# EAGLE schematic HoverBoard_CoolAndFun (EAGLE 8.3.0)

## Sheet 1 of 2
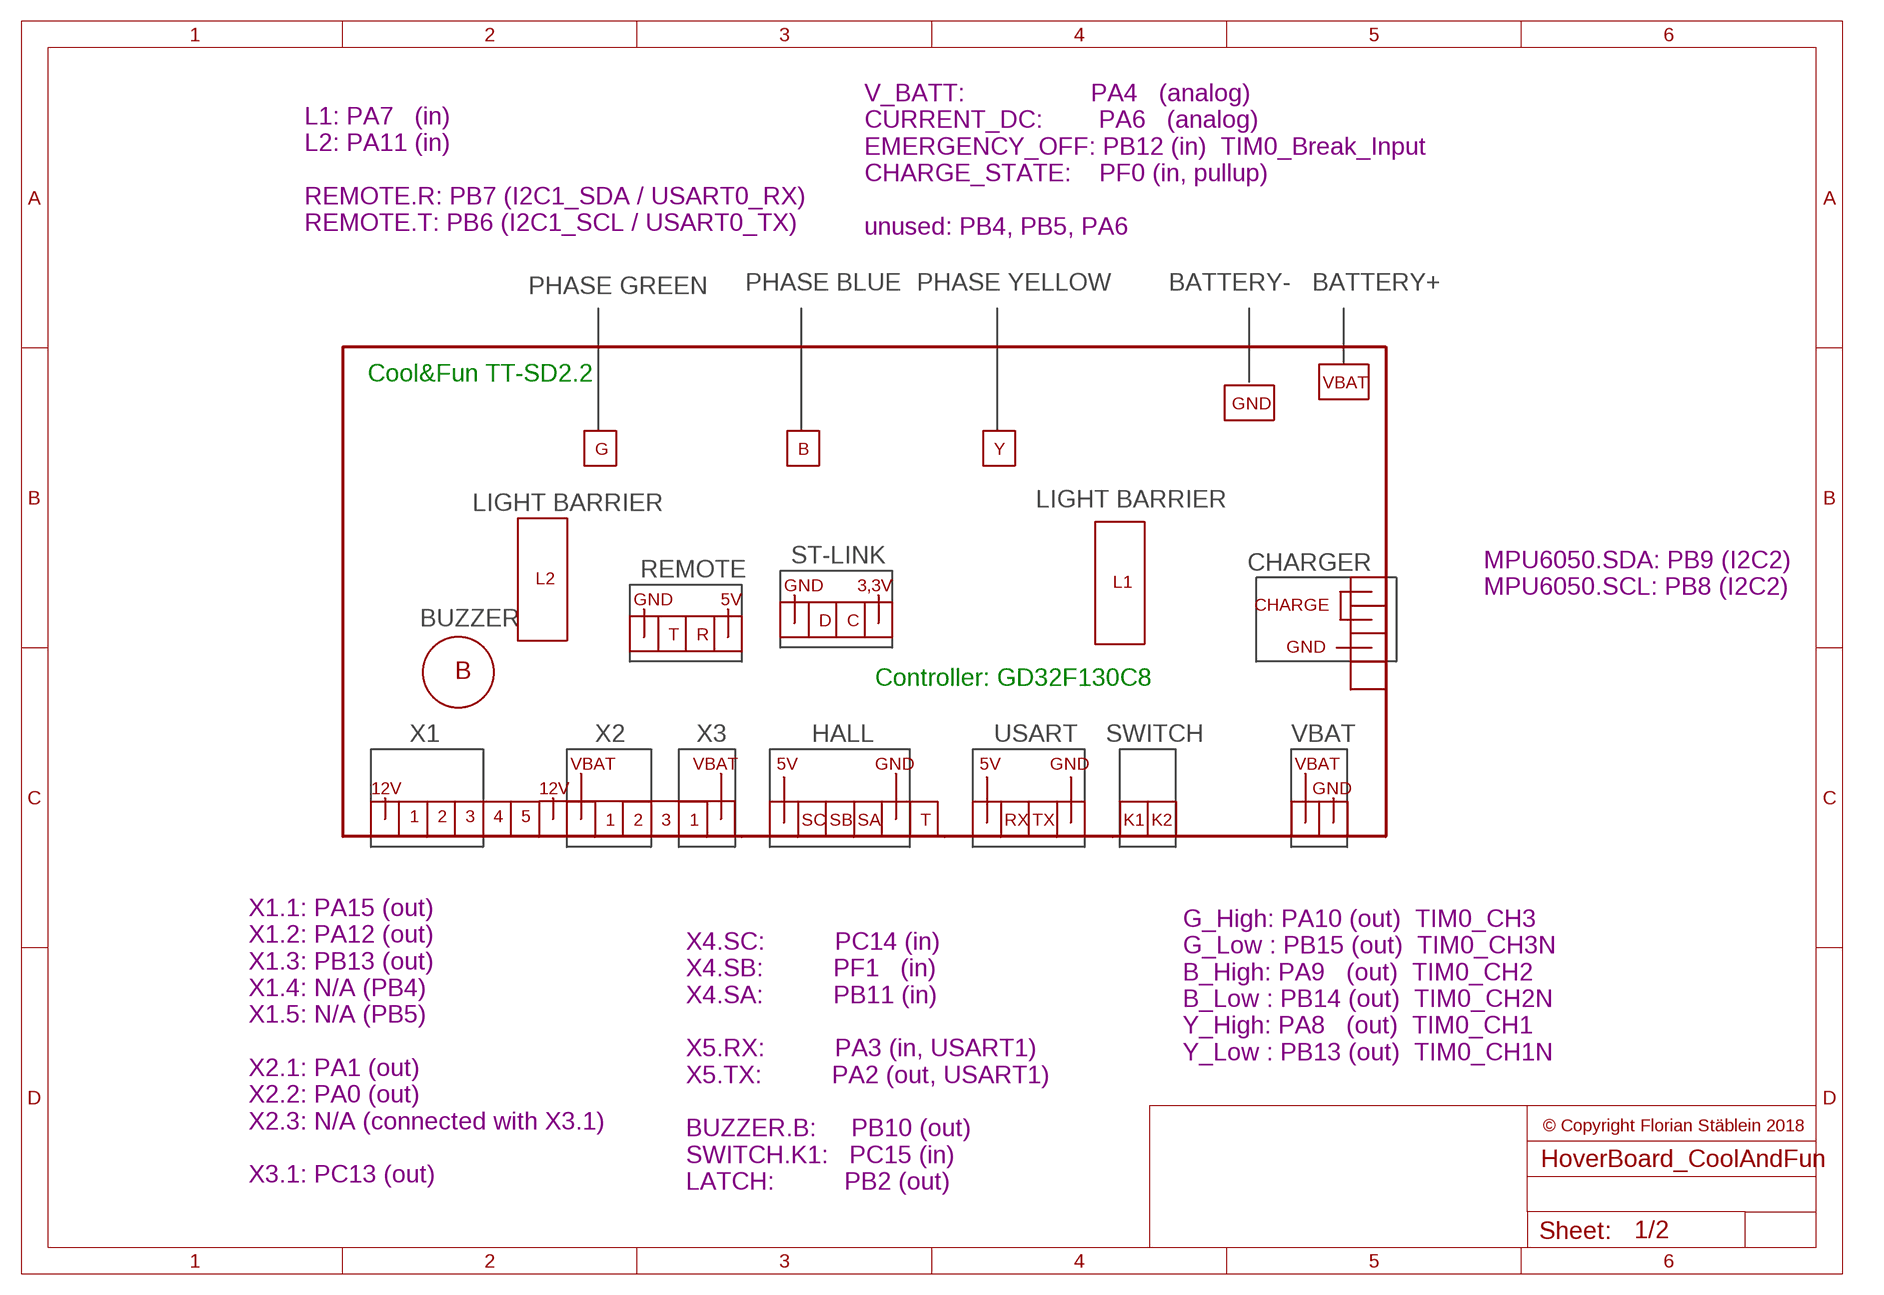
[diagram p0: schematic, sheet 1]

### Notes on the sheet
- L1: PA7   (in)
  L2: PA11 (in)
  
  REMOTE.R: PB7 (I2C1_SDA / USART0_RX)
  REMOTE.T: PB6 (I2C1_SCL / USART0_TX)
- V_BATT:                  PA4   (analog)
  CURRENT_DC:        PA6   (analog)
  EMERGENCY_OFF: PB12 (in)  TIM0_Break_Input
  CHARGE_STATE:    PF0 (in, pullup)
  
  unused: PB4, PB5, PA6
- PHASE GREEN | PHASE BLUE | PHASE YELLOW | BATTERY- | BATTERY+
- Cool&Fun TT-SD2.2
- VBAT
- GND
- G | B | Y
- LIGHT BARRIER | LIGHT BARRIER
- CHARGER
- ST-LINK
- REMOTE
- L2 | L1
- GND | 3,3V
- MPU6050.SDA: PB9 (I2C2)
  MPU6050.SCL: PB8 (I2C2)
- CHARGE
- GND | 5V
- BUZZER | D | C
- T | R | GND
- B | Controller: GD32F130C8
- X1 | X2 | X3 | HALL | USART | SWITCH | VBAT
- VBAT | VBAT | 5V | GND | 5V | GND | VBAT
- 12V | 12V | GND
- 1 | 2 | 3 | 4 | 5 | 1 | 2 | 3 | 1 | SC | SB | SA | T | RX | TX | K1 | K2
- G_High: PA10 (out)  TIM0_CH3
  G_Low : PB15 (out)  TIM0_CH3N
  B_High: PA9   (out)  TIM0_CH2
  B_Low : PB14 (out)  TIM0_CH2N
  Y_High: PA8   (out)  TIM0_CH1
  Y_Low : PB13 (out)  TIM0_CH1N
- © Copyright Florian Stäblein 2018
- X1.1: PA15 (out)
  X1.2: PA12 (out)
  X1.3: PB13 (out)
  X1.4: N/A (PB4)
  X1.5: N/A (PB5)
  
  X2.1: PA1 (out)
  X2.2: PA0 (out)
  X2.3: N/A (connected with X3.1)
  
  X3.1: PC13 (out)
- X4.SC:          PC14 (in)
  X4.SB:          PF1   (in)
  X4.SA:          PB11 (in)
  
  X5.RX:          PA3 (in, USART1)
  X5.TX:          PA2 (out, USART1)
  
  BUZZER.B:     PB10 (out)
  SWITCH.K1:   PC15 (in)
  LATCH:          PB2 (out)

## Sheet 2 of 2
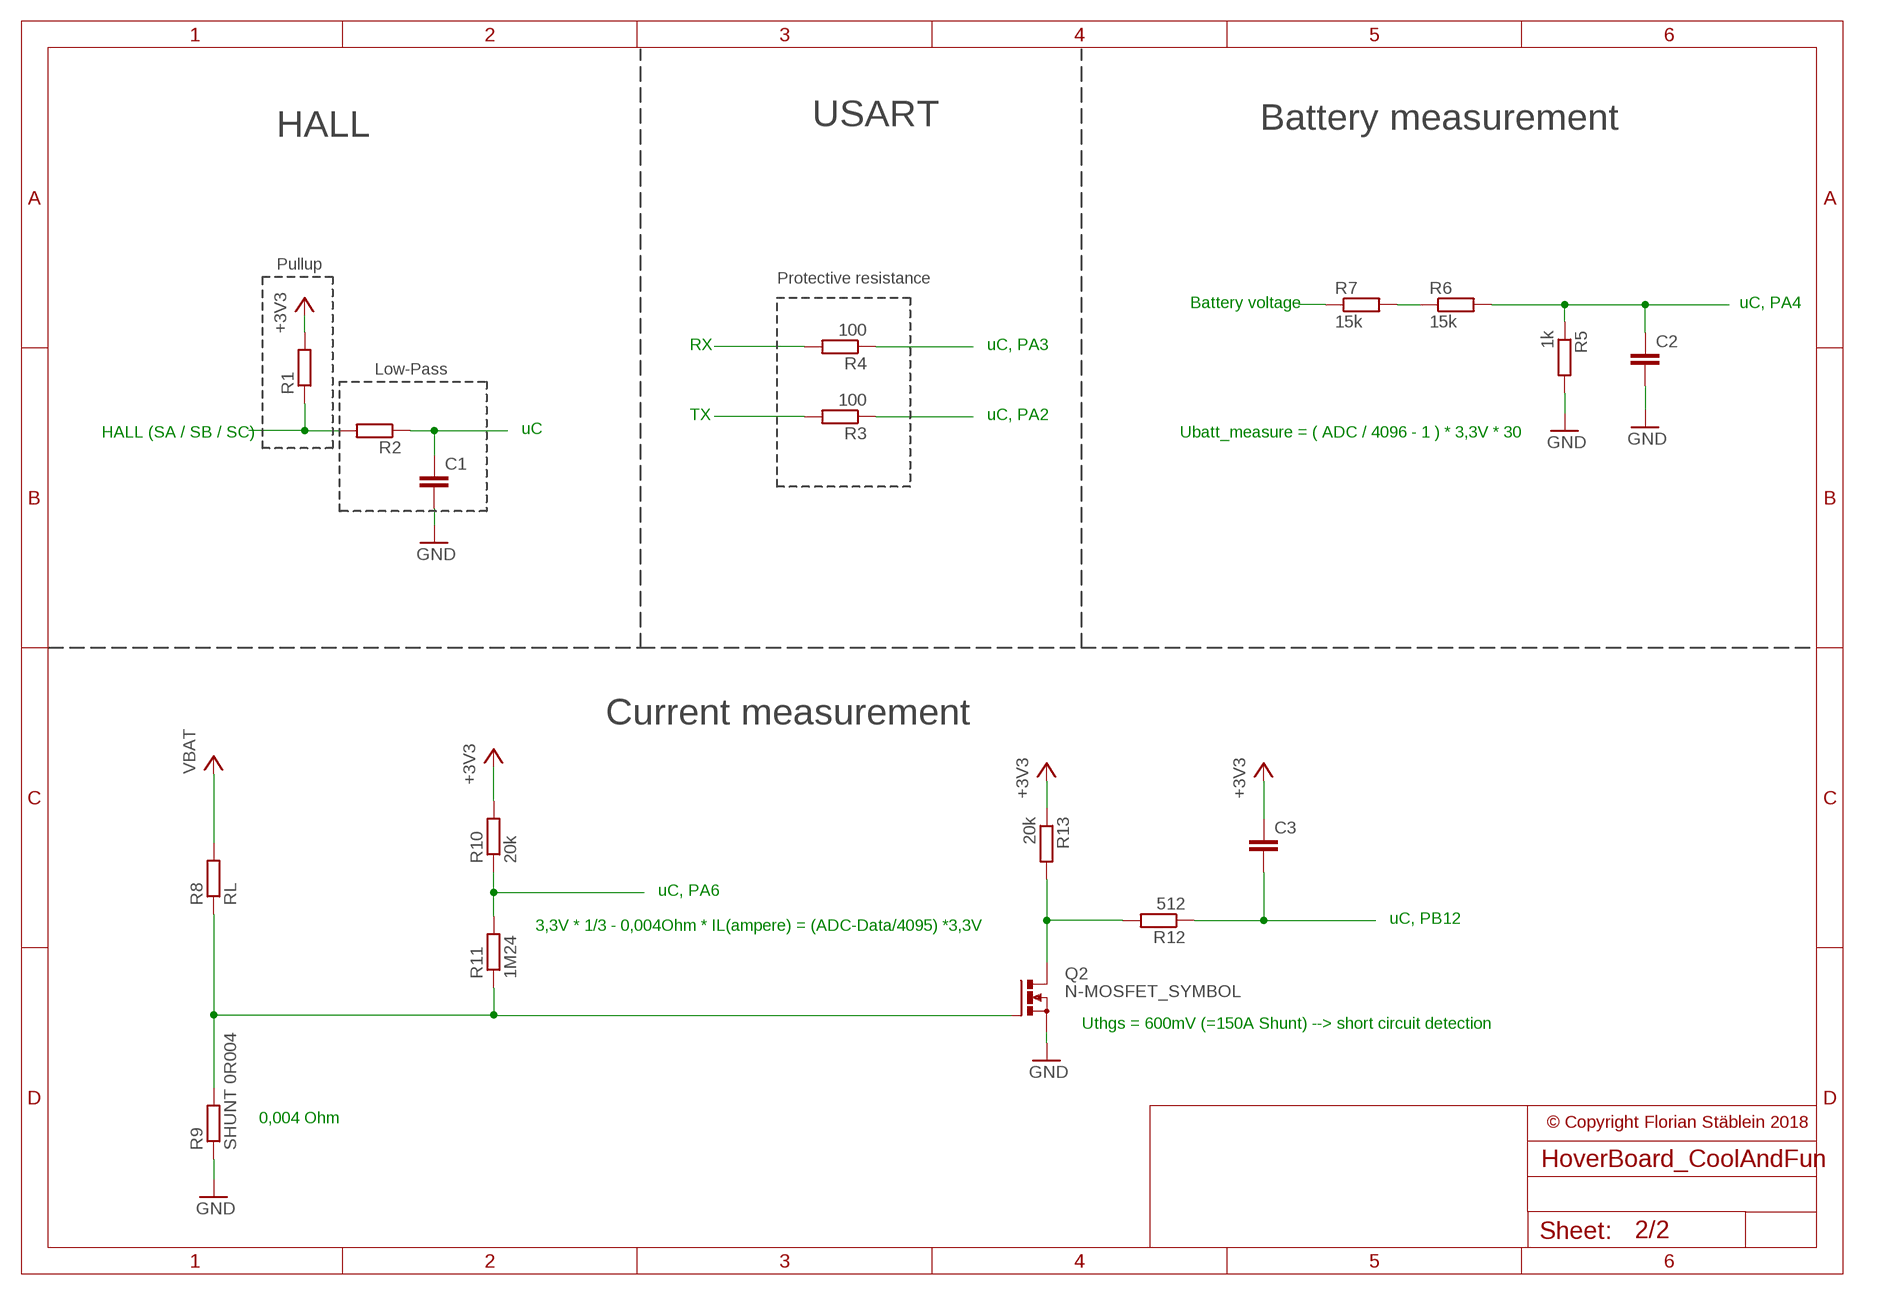
[diagram p1: schematic, sheet 2]

### Parts
C1  C-EU025-025X050  [C025-025X050]
C2  C-EU025-025X050  [C025-025X050]
C3  C-EU025-025X050  [C025-025X050]
R1  R-EU_0207/2V  [0207/2V]
R2  R-EU_0207/2V  [0207/2V]
R3  100  R-EU_0207/2V  [0207/2V]
R4  100  R-EU_0207/2V  [0207/2V]
R5  1k  R-EU_0207/2V  [0207/2V]
R6  15k  R-EU_0207/2V  [0207/2V]
R7  15k  R-EU_0207/2V  [0207/2V]
R8  RL  R-EU_0207/2V  [0207/2V]
R9  SHUNT 0R004  R-EU_0207/2V  [0207/2V]
R10  20k  R-EU_0207/2V  [0207/2V]
R11  1M24  R-EU_0207/2V  [0207/2V]
R12  512  R-EU_0207/2V  [0207/2V]
R13  20k  R-EU_0207/2V  [0207/2V]

### Nets
+3V3: C3.1 R1.2 R10.2 R13.1
GND: C1.2 C2.2 R5.2 R9.1
N$1: R1.1 R2.2
N$2: C1.1 R2.1
N$3: R4.2
N$4: R4.1
N$5: R3.2
N$6: R3.1
N$7: R7.1
N$8: R6.1 R7.2
N$9: C2.1 R5.1 R6.2
N$10: R8.1 R9.2 R11.1
N$11: R10.1 R11.2
N$12: R12.2 R13.2
N$13: C3.2 R12.1
VCC: R8.2 ; supply symbol labelled VBAT

### Notes on the sheet
- HALL | USART | Battery measurement
- Pullup
- Protective resistance
- Battery voltage | uC, PA4
- RX | uC, PA3
- Low-Pass
- TX | uC, PA2
- HALL (SA / SB / SC) | uC | Ubatt_measure = ( ADC / 4096 - 1 ) * 3,3V * 30
- Current measurement
- uC, PA6
- uC, PB12
- 3,3V * 1/3 - 0,004Ohm * IL(ampere) = (ADC-Data/4095) *3,3V
- Uthgs = 600mV (=150A Shunt) --> short circuit detection
- 0,004 Ohm
- © Copyright Florian Stäblein 2018

## Library data of the parts
C1-C3 = rcl:C-EU: CAPACITOR, European symbol
R1-R13 = rcl:R-EU_: RESISTOR, European symbol